# Altium schematic sheet Sheet1.SchDoc
size 420 x 297 mm; Scale: 1:1; Разраб.: Косяков Д.; Пров.: Гюльмалиев Э.; Утв.: Гюльмалиев Э.; Номер листа: 1; Общее количество листов: 2; Масштаб: 1:1; Наименование организации: ГБПОУ "1-й МОК"; Наименование изделия 1: Плата управления LED куба; Наименование изделия 2: Схема электрическая; Наименование изделия 3: принципиальная; Нач. отд.: Науч.рук; Фамилия нач. отд.: Гюльмалиев Э.; SheetNumber: 1; SheetTotal: 2
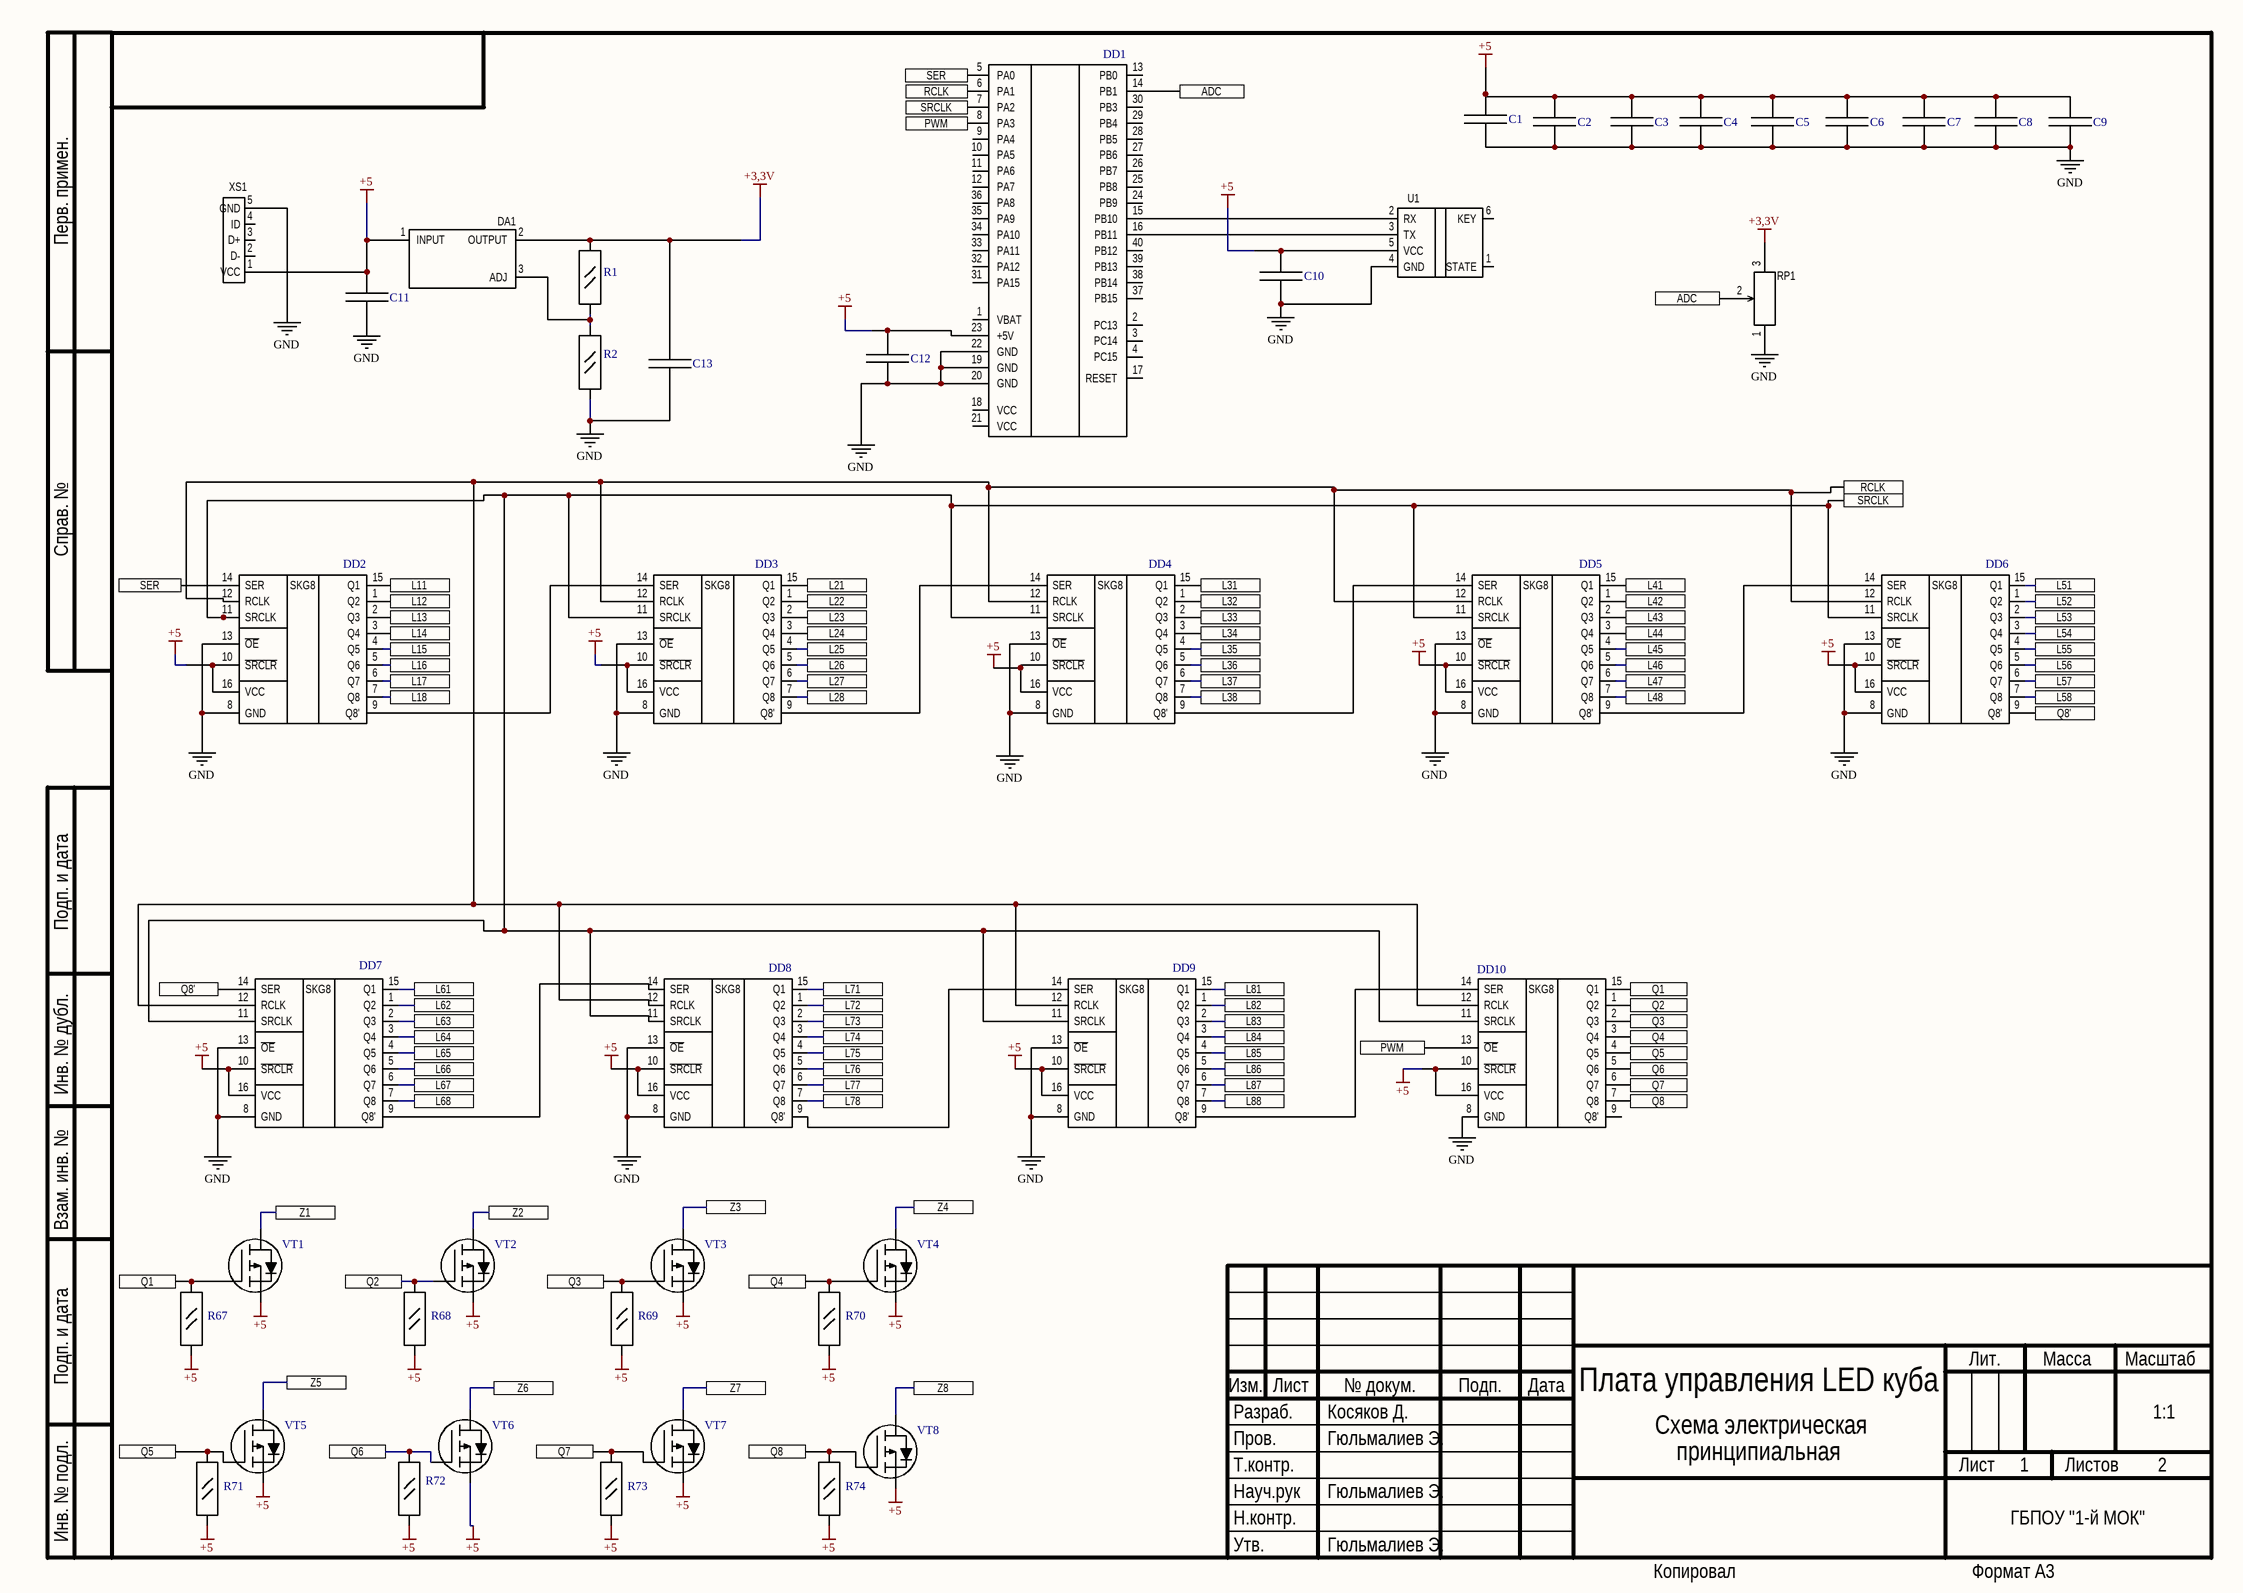
[diagram p0: Sheet1.SchDoc]

## Parts
C1  0.1uF  [CAPC2112X13N]  (value not drawn)
C2  0.1uF  [CAPC2112X13N]  (value not drawn)
C3  0.1uF  [CAPC2112X13N]  (value not drawn)
C4  0.1uF  [CAPC2112X13N]  (value not drawn)
C5  0.1uF  [CAPC2112X13N]  (value not drawn)
C6  0.1uF  [CAPC2112X13N]  (value not drawn)
C7  0.1uF  [CAPC2112X13N]  (value not drawn)
C8  0.1uF  [CAPC2112X13N]  (value not drawn)
C9  0.1uF  [CAPC2112X13N]  (value not drawn)
C10  0.1uF  [CAPC2112X13N]  (value not drawn)
C11  0.1uF  [CAPC2112X13N]  (value not drawn)
C12  0.1uF  [CAPC2112X13N]  (value not drawn)
C13  1u.F  [CAPC2112X13N]  (value not drawn)
DA1  LM317  [SOT230P700X180-4N]  (value not drawn)
DD1  STM32F103C8T6  [stm32f103]  (value not drawn)
DD2  74HC595  [SOIC127P600X175-16N]  (value not drawn)
DD3  74HC595  [SOIC127P600X175-16N]  (value not drawn)
DD4  74HC595  [SOIC127P600X175-16N]  (value not drawn)
DD5  74HC595  [SOIC127P600X175-16N]  (value not drawn)
DD6  74HC595  [SOIC127P600X175-16N]  (value not drawn)
DD7  74HC595  [SOIC127P600X175-16N]  (value not drawn)
DD8  74HC595  [SOIC127P600X175-16N]  (value not drawn)
DD9  74HC595  [SOIC127P600X175-16N]  (value not drawn)
DD10  74HC595  [SOIC127P600X175-16N]  (value not drawn)
R1  240Ом  [RESC2113X06N]  (value not drawn)
R2  390 Ом  [RESC2113X06N]  (value not drawn)
R67  10k  [RESC2113X06N]  (value not drawn)
R68  10k  [RESC2113X06N]  (value not drawn)
R69  10k  [RESC2113X06N]  (value not drawn)
R70  10k  [RESC2113X06N]  (value not drawn)
R71  10k  [RESC2113X06N]  (value not drawn)
R72  10k  [RESC2113X06N]  (value not drawn)
R73  10k  [RESC2113X06N]  (value not drawn)
R74  10k  [RESC2113X06N]  (value not drawn)
RP1  Potent  [Potent1]  (value not drawn)
U1  HC-05  [HC-05]  (value not drawn)
VT1  P-channel  [SOT95P245X120-3N]  (value not drawn)
VT2  P-channel  [SOT95P245X120-3N]  (value not drawn)
VT3  P-channel  [SOT95P245X120-3N]  (value not drawn)
VT4  P-channel  [SOT95P245X120-3N]  (value not drawn)
VT5  P-channel  [SOT95P245X120-3N]  (value not drawn)
VT6  P-channel  [SOT95P245X120-3N]  (value not drawn)
VT7  P-channel  [SOT95P245X120-3N]  (value not drawn)
VT8  P-channel  [SOT95P245X120-3N]  (value not drawn)
XS1  USB  [USB]  (value not drawn)

## Ports
ADC, L11, L12, L13, L14, L15, L16, L17, L18, L21, L22, L23, L24, L25, L26, L27, L28, L31, L32, L33, L34, L35, L36, L37, L38, L41, L42, L43, L44, L45, L46, L47, L48, L51, L52, L53, L54, L55, L56, L57, L58, L61, L62, L63, L64, L65, L66, L67, L68, L71, L72, L73, L74, L75, L76, L77, L78, L81, L82, L83, L84, L85, L86, L87, L88, PWM, Q1, Q2, Q3, Q4, Q5, Q6, Q7, Q8, Q8', RCLK, SER, SRCLK, Z1, Z2, Z3, Z4, Z5, Z6, Z7, Z8

## Nets
+3,3V: C13.2 DA1.2(OUTPUT) R1.1 RP1.3
+5: C1.2 C2.2 C3.2 C4.2 C5.2 C6.2 C7.2 C8.2 C9.2 C10.2 C11.2 C12.2 DA1.1(INPUT) DD1.23(+5V) DD2.10(~{SRCLR}) DD2.16(VCC) DD3.10(~{SRCLR}) DD3.16(VCC) DD4.10(~{SRCLR}) DD4.16(VCC) DD5.10(~{SRCLR}) DD5.16(VCC) DD6.10(~{SRCLR}) DD6.16(VCC) DD7.10(~{SRCLR}) DD7.16(VCC) DD8.10(~{SRCLR}) DD8.16(VCC) DD9.10(~{SRCLR}) DD9.16(VCC) DD10.10(~{SRCLR}) DD10.16(VCC) R67.1 R68.1 R69.1 R70.1 R71.1 R72.1 R73.1 R74.1 U1.5(VCC) VT1.2 VT2.2 VT3.2 VT4.2 VT5.2 VT6.2 VT7.2 VT8.2 XS1.1(VCC)
GND: C1.1 C2.1 C3.1 C4.1 C5.1 C6.1 C7.1 C8.1 C9.1 C10.1 C11.1 C12.1 C13.1 DD1.19(GND) DD1.20(GND) DD1.22(GND) DD2.8(GND) DD2.13(~{OE}) DD3.8(GND) DD3.13(~{OE}) DD4.8(GND) DD4.13(~{OE}) DD5.8(GND) DD5.13(~{OE}) DD6.8(GND) DD6.13(~{OE}) DD7.8(GND) DD7.13(~{OE}) DD8.8(GND) DD8.13(~{OE}) DD9.8(GND) DD9.13(~{OE}) DD10.8(GND) R2.1 RP1.1 U1.4(GND) XS1.5(GND)
ADC: DD1.14(PB1) RP1.2 ; port ADC
L11: DD2.15(Q1) ; port L11
L12: DD2.1(Q2) ; port L12
L13: DD2.2(Q3) ; port L13
L14: DD2.3(Q4) ; port L14
L15: DD2.4(Q5) ; port L15
L16: DD2.5(Q6) ; port L16
L17: DD2.6(Q7) ; port L17
L18: DD2.7(Q8) ; port L18
L21: DD3.15(Q1) ; port L21
L22: DD3.1(Q2) ; port L22
L23: DD3.2(Q3) ; port L23
L24: DD3.3(Q4) ; port L24
L25: DD3.4(Q5) ; port L25
L26: DD3.5(Q6) ; port L26
L27: DD3.6(Q7) ; port L27
L28: DD3.7(Q8) ; port L28
L31: DD4.15(Q1) ; port L31
L32: DD4.1(Q2) ; port L32
L33: DD4.2(Q3) ; port L33
L34: DD4.3(Q4) ; port L34
L35: DD4.4(Q5) ; port L35
L36: DD4.5(Q6) ; port L36
L37: DD4.6(Q7) ; port L37
L38: DD4.7(Q8) ; port L38
L41: DD5.15(Q1) ; port L41
L42: DD5.1(Q2) ; port L42
L43: DD5.2(Q3) ; port L43
L44: DD5.3(Q4) ; port L44
L45: DD5.4(Q5) ; port L45
L46: DD5.5(Q6) ; port L46
L47: DD5.6(Q7) ; port L47
L48: DD5.7(Q8) ; port L48
L51: DD6.15(Q1) ; port L51
L52: DD6.1(Q2) ; port L52
L53: DD6.2(Q3) ; port L53
L54: DD6.3(Q4) ; port L54
L55: DD6.4(Q5) ; port L55
L56: DD6.5(Q6) ; port L56
L57: DD6.6(Q7) ; port L57
L58: DD6.7(Q8) ; port L58
L61: DD7.15(Q1) ; port L61
L62: DD7.1(Q2) ; port L62
L63: DD7.2(Q3) ; port L63
L64: DD7.3(Q4) ; port L64
L65: DD7.4(Q5) ; port L65
L66: DD7.5(Q6) ; port L66
L67: DD7.6(Q7) ; port L67
L68: DD7.7(Q8) ; port L68
L71: DD8.15(Q1) ; port L71
L72: DD8.1(Q2) ; port L72
L73: DD8.2(Q3) ; port L73
L74: DD8.3(Q4) ; port L74
L75: DD8.4(Q5) ; port L75
L76: DD8.5(Q6) ; port L76
L77: DD8.6(Q7) ; port L77
L78: DD8.7(Q8) ; port L78
L81: DD9.15(Q1) ; port L81
L82: DD9.1(Q2) ; port L82
L83: DD9.2(Q3) ; port L83
L84: DD9.3(Q4) ; port L84
L85: DD9.4(Q5) ; port L85
L86: DD9.5(Q6) ; port L86
L87: DD9.6(Q7) ; port L87
L88: DD9.7(Q8) ; port L88
PWM: DD1.8(PA3) DD10.13(~{OE}) ; port PWM
Q1: DD10.15(Q1) R67.2 VT1.1 ; port Q1
Q2: DD10.1(Q2) R68.2 VT2.1 ; port Q2
Q3: DD10.2(Q3) R69.2 VT3.1 ; port Q3
Q4: DD10.3(Q4) R70.2 VT4.1 ; port Q4
Q5: DD10.4(Q5) R71.2 VT5.1 ; port Q5
Q6: DD10.5(Q6) R72.2 VT6.1 ; port Q6
Q7: DD10.6(Q7) R73.2 VT7.1 ; port Q7
Q8: DD10.7(Q8) R74.2 VT8.1 ; port Q8
Q8': DD6.9(Q8') DD7.14(SER) ; port Q8'
RCLK: DD1.6(PA1) DD2.12(RCLK) DD3.12(RCLK) DD4.12(RCLK) DD5.12(RCLK) DD6.12(RCLK) DD7.12(RCLK) DD8.12(RCLK) DD9.12(RCLK) DD10.12(RCLK) ; port RCLK
SER: DD1.5(PA0) DD2.14(SER) ; port SER
SRCLK: DD1.7(PA2) DD2.11(SRCLK) DD3.11(SRCLK) DD4.11(SRCLK) DD5.11(SRCLK) DD6.11(SRCLK) DD7.11(SRCLK) DD8.11(SRCLK) DD9.11(SRCLK) DD10.11(SRCLK) ; port SRCLK
Z1: VT1.3 ; port Z1
Z2: VT2.3 ; port Z2
Z3: VT3.3 ; port Z3
Z4: VT4.3 ; port Z4
Z5: VT5.3 ; port Z5
Z6: VT6.3 ; port Z6
Z7: VT7.3 ; port Z7
Z8: VT8.3 ; port Z8
NetDA1_3: DA1.3(ADJ) R1.2 R2.2
NetDD1_15: DD1.15(PB10) U1.2(RX)
NetDD1_16: DD1.16(PB11) U1.3(TX)
NetDD2_9: DD2.9(Q8') DD3.14(SER)
NetDD3_9: DD3.9(Q8') DD4.14(SER)
NetDD4_9: DD4.9(Q8') DD5.14(SER)
NetDD5_9: DD5.9(Q8') DD6.14(SER)
NetDD7_9: DD7.9(Q8') DD8.14(SER)
NetDD8_9: DD8.9(Q8') DD9.14(SER)
NetDD9_9: DD9.9(Q8') DD10.14(SER)

Not connected (* = marked no-connect by the designer): DD1 1(VBAT) 2(PC13) 3(PC14) 4(PC15) 9(PA4) 10(PA5) 11(PA6) 12(PA7) 13(PB0) 17(RESET) 18(VCC) 21(VCC) 24(PB9) 25(PB8) 26(PB7) 27(PB6) 28(PB5) 29(PB4) 30(PB3) 31(PA15) 32(PA12) 33(PA11) 34(PA10) 35(PA9) 36(PA8) 37(PB15) 38(PB14) 39(PB13) 40(PB12); DD10 9(Q8'); U1 1(STATE) 6(KEY); XS1 2(D-) 3(D+) 4(ID)

## Notes on the sheet
- Перв. примен.
- Справ. №
- Подп. и дата
- Инв. № дубл.
- Взам. инв. №
- Разраб.
- Изм.
- Лист
- № докум.
- Подп.
- Дата
- Лит.
- Масса
- Масштаб
- Пров.
- Т.контр.
- Листов
- Инв. № подл.
- Утв.
- Н.контр.
- Копировал
- Формат А3
- (in symbol 74HC595) SKG8

## Library data of the parts
DA1 = LM317: Регулируемый стабилизатор напряжения
DD2-DD10 = 74HC595: Сдвиговый регистр
R67-R74 = Резистор 0805
RP1 = Potent: Переменный резистор 10кОм
VT1-VT8 = P-channel: Транзистор MOSFET N-канальный